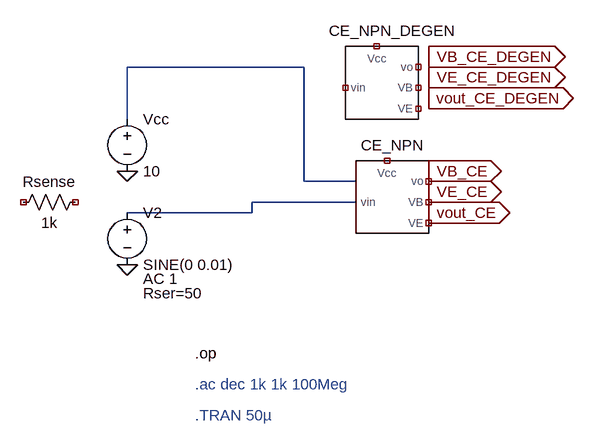
[diagram p0: schematic lab5_sims_amp.asc]
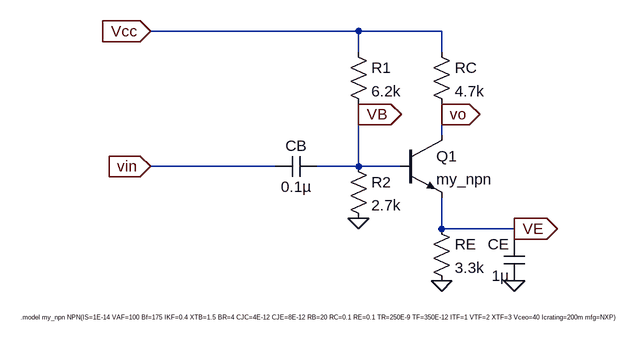
[diagram p1: sub-circuit lab5_sims_ce_npn.asc]
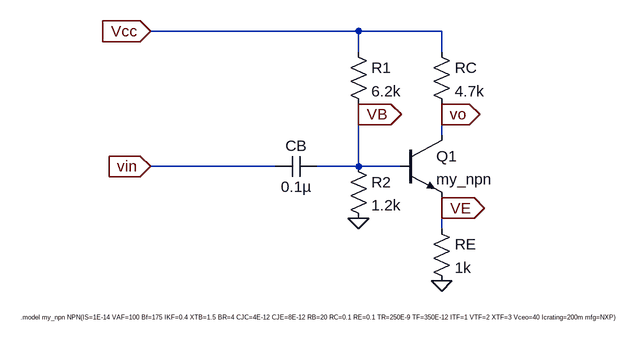
[diagram p2: sub-circuit dp1_ce_npn_degen.asc]
lab5_sims_amp.asc, the LTspice schematic file:
Version 4
SHEET 1 2800 1584
WIRE 96 -64 -176 -64
WIRE -176 16 -176 -64
WIRE 96 112 96 -64
WIRE 176 112 96 112
WIRE 176 144 16 144
WIRE 16 160 16 144
WIRE 16 160 -176 160
FLAG 288 128 VE_CE
IOPIN 288 128 Out
FLAG 288 160 vout_CE
IOPIN 288 160 Out
FLAG 288 96 VB_CE
IOPIN 288 96 Out
FLAG 288 -48 VE_CE_DEGEN
IOPIN 288 -48 Out
FLAG 288 -16 vout_CE_DEGEN
IOPIN 288 -16 Out
FLAG 288 -80 VB_CE_DEGEN
IOPIN 288 -80 Out
FLAG -176 96 0
FLAG -176 240 0
SYMBOL lab5_sims_CE_NPN 224 128 R0
WINDOW 0 8 -56 Bottom 2
SYMATTR InstName CE_NPN
SYMBOL dp1_CE_NPN_DEGEN 224 -48 R0
WINDOW 0 8 -56 Bottom 2
SYMATTR InstName CE_NPN_DEGEN
SYMBOL voltage -176 0 R0
SYMATTR InstName Vcc
SYMATTR Value 10
SYMBOL voltage -176 144 R0
WINDOW 123 24 118 Left 2
WINDOW 39 24 140 Left 2
SYMATTR Value2 AC 1
SYMATTR SpiceLine Rser=50
SYMATTR InstName V2
SYMATTR Value SINE(0 0.01)
SYMBOL Res -240 128 R90
WINDOW 0 0 56 VBottom 2
WINDOW 3 32 56 VTop 2
SYMATTR InstName Rsense
SYMATTR Value 1k
TEXT -72 376 Left 2 !.op
TEXT -72 424 Left 2 ;.ac dec 1k 1k 100Meg
TEXT -72 472 Left 2 ;.TRAN 50µ

lab5_sims_ce_npn.asc, the sub-circuit schematic file:
Version 4
SHEET 1 2800 760
WIRE 352 144 32 144
WIRE 480 144 352 144
WIRE 352 176 352 144
WIRE 480 176 480 144
WIRE 352 272 352 256
WIRE 480 272 480 256
WIRE 480 304 480 272
WIRE 224 352 32 352
WIRE 352 352 352 272
WIRE 352 352 288 352
WIRE 416 352 352 352
WIRE 480 448 480 400
WIRE 592 448 480 448
WIRE 592 464 592 448
FLAG 480 528 0
FLAG 592 528 0
FLAG 352 432 0
FLAG 480 272 vo
IOPIN 480 272 Out
FLAG 592 448 VE
IOPIN 592 448 Out
FLAG 352 272 VB
IOPIN 352 272 Out
FLAG 32 144 Vcc
IOPIN 32 144 In
FLAG 32 352 vin
IOPIN 32 352 In
SYMBOL npn 416 304 R0
SYMATTR InstName Q1
SYMATTR Value my_npn
SYMBOL Res 464 160 R0
SYMATTR InstName RC
SYMATTR Value 4.7k
SYMBOL Res 464 432 R0
SYMATTR InstName RE
SYMATTR Value 3.3k
SYMBOL Res 336 160 R0
SYMATTR InstName R1
SYMATTR Value 6.2k
SYMBOL Res 336 336 R0
SYMATTR InstName R2
SYMATTR Value 2.7k
SYMBOL Cap 288 336 R90
WINDOW 0 0 32 VBottom 2
WINDOW 3 32 32 VTop 2
SYMATTR InstName CB
SYMATTR Value 0.1µ
SYMBOL Cap 608 528 R180
WINDOW 0 24 56 Left 2
WINDOW 3 24 8 Left 2
SYMATTR InstName CE
SYMATTR Value 1µ
TEXT -168 584 Left 0 !.model my_npn NPN(IS=1E-14 VAF=100 Bf=175 IKF=0.4 XTB=1.5 BR=4 CJC=4E-12 CJE=8E-12 RB=20 RC=0.1 RE=0.1 TR=250E-9 TF=350E-12 ITF=1 VTF=2 XTF=3 Vceo=40 Icrating=200m mfg=NXP)

dp1_ce_npn_degen.asc, the sub-circuit schematic file:
Version 4
SHEET 1 2800 760
WIRE 352 144 32 144
WIRE 480 144 352 144
WIRE 352 176 352 144
WIRE 480 176 480 144
WIRE 352 272 352 256
WIRE 480 272 480 256
WIRE 480 304 480 272
WIRE 224 352 32 352
WIRE 352 352 352 272
WIRE 352 352 288 352
WIRE 416 352 352 352
WIRE 480 416 480 400
WIRE 480 448 480 416
FLAG 480 528 0
FLAG 352 432 0
FLAG 480 272 vo
IOPIN 480 272 Out
FLAG 480 416 VE
IOPIN 480 416 Out
FLAG 352 272 VB
IOPIN 352 272 Out
FLAG 32 144 Vcc
IOPIN 32 144 In
FLAG 32 352 vin
IOPIN 32 352 In
SYMBOL npn 416 304 R0
SYMATTR InstName Q1
SYMATTR Value my_npn
SYMBOL Res 464 160 R0
SYMATTR InstName RC
SYMATTR Value 4.7k
SYMBOL Res 464 432 R0
SYMATTR InstName RE
SYMATTR Value 1k
SYMBOL Res 336 160 R0
SYMATTR InstName R1
SYMATTR Value 6.2k
SYMBOL Res 336 336 R0
SYMATTR InstName R2
SYMATTR Value 1.2k
SYMBOL Cap 288 336 R90
WINDOW 0 0 32 VBottom 2
WINDOW 3 32 32 VTop 2
SYMATTR InstName CB
SYMATTR Value 0.1µ
TEXT -168 584 Left 0 !.model my_npn NPN(IS=1E-14 VAF=100 Bf=175 IKF=0.4 XTB=1.5 BR=4 CJC=4E-12 CJE=8E-12 RB=20 RC=0.1 RE=0.1 TR=250E-9 TF=350E-12 ITF=1 VTF=2 XTF=3 Vceo=40 Icrating=200m mfg=NXP)

The netlist it stands for:
* lab5_sims_amp.asc
* CE_NPN: lab5_sims_ce_npn (symbol lab5_sims_CE_NPN not certain, pin order unknown); nets seen at it: N002
XCE_NPN_DEGEN NC_05 NC_06 NC_07 NC_08 NC_09 dp1_ce_npn_degen
Vcc N001 0 10
V2 N002 0 SINE(0 0.01) AC 1 Rser=50
Rsense NC_10 NC_11 1k

* block symbol definitions
.subckt lab5_sims_ce_npn Vcc vin VB VE vo
Q1 vo VB VE 0 my_npn
RC Vcc vo 4.7k
RE VE 0 3.3k
R1 Vcc VB 6.2k
R2 VB 0 2.7k
CB VB vin 0.1µ
CE 0 VE 1µ
.model my_npn NPN(IS=1E-14 VAF=100 Bf=175 IKF=0.4 XTB=1.5 BR=4 CJC=4E-12 CJE=8E-12 RB=20 RC=0.1 RE=0.1 TR=250E-9 TF=350E-12 ITF=1 VTF=2 XTF=3 Vceo=40 Icrating=200m mfg=NXP)
.ends lab5_sims_ce_npn

.subckt dp1_ce_npn_degen Vcc vin VB VE vo
Q1 vo VB VE 0 my_npn
RC Vcc vo 4.7k
RE VE 0 1k
R1 Vcc VB 6.2k
R2 VB 0 1.2k
CB VB vin 0.1µ
.model my_npn NPN(IS=1E-14 VAF=100 Bf=175 IKF=0.4 XTB=1.5 BR=4 CJC=4E-12 CJE=8E-12 RB=20 RC=0.1 RE=0.1 TR=250E-9 TF=350E-12 ITF=1 VTF=2 XTF=3 Vceo=40 Icrating=200m mfg=NXP)
.ends dp1_ce_npn_degen

.model NPN NPN
.model PNP PNP
.lib standard.bjt
.op
* .ac dec 1k 1k 100Meg
* .TRAN 50µ
.backanno
.end